# EAGLE board ESP32-P4 Display 9.0 inch V1.0 (EAGLE 9.6.2), part 1 of 3
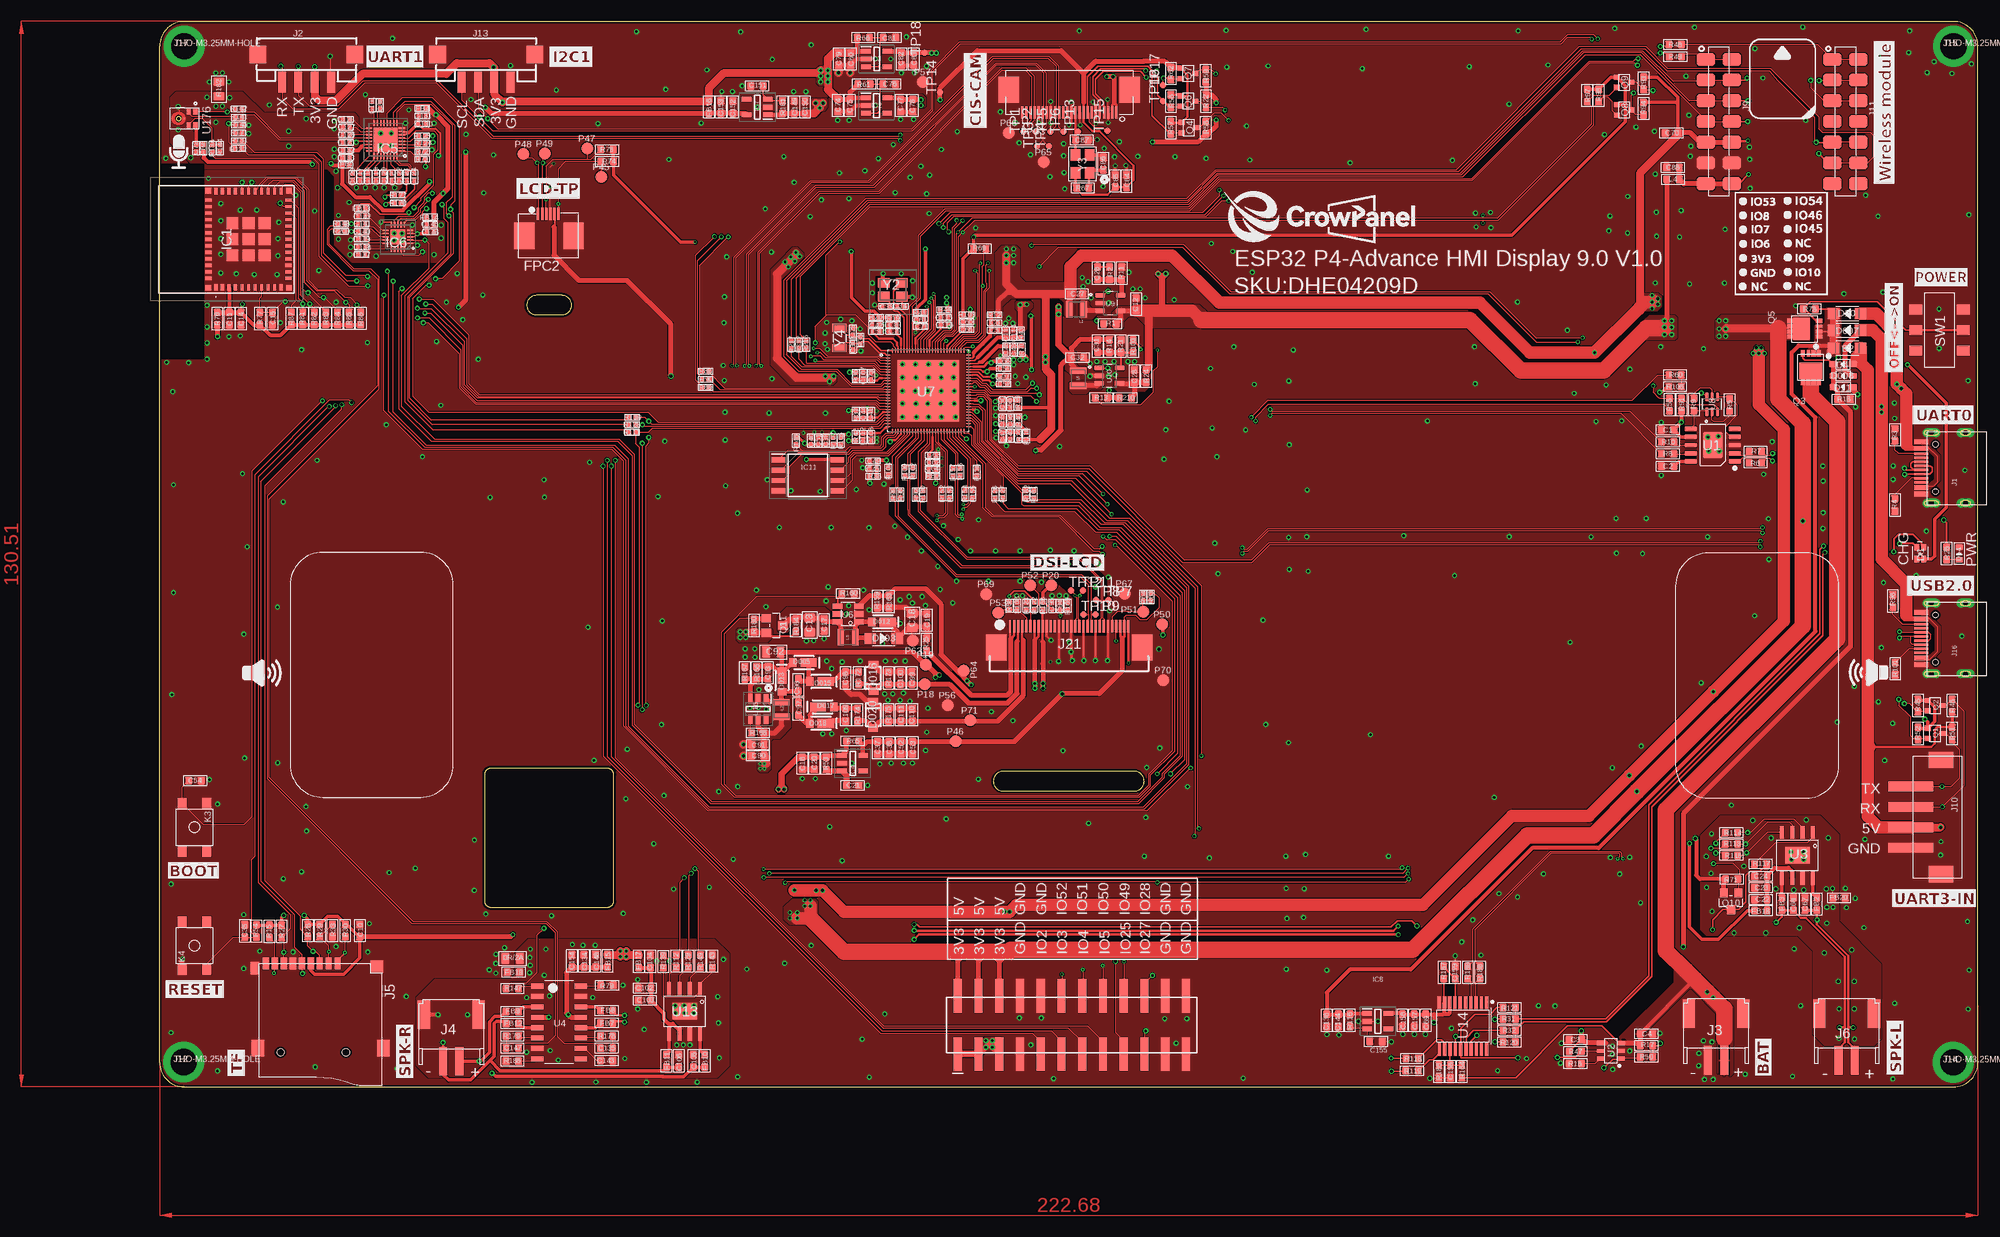
[diagram p9: board, top side]
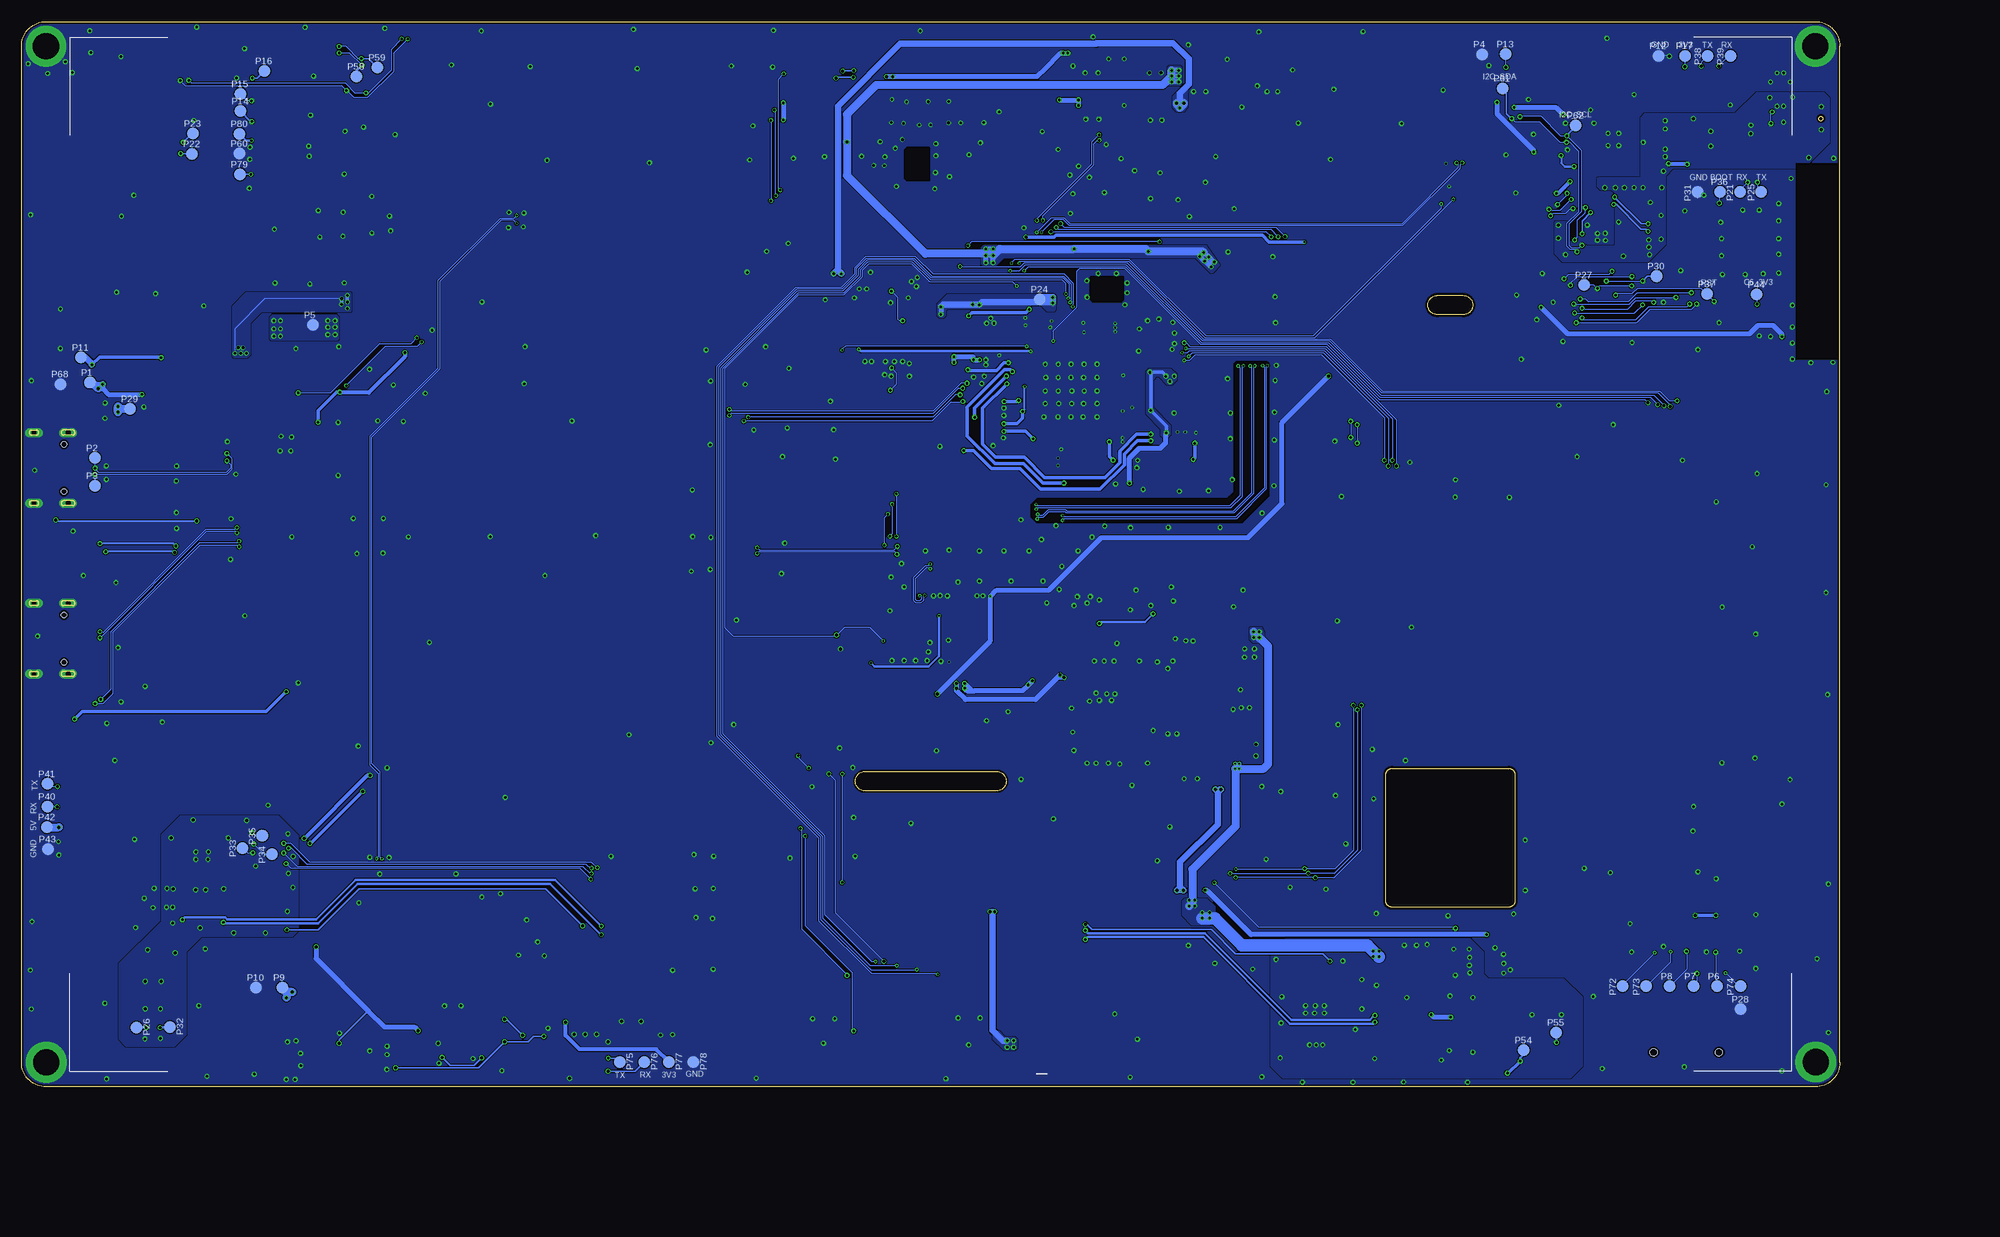
[diagram p10: board, bottom side, seen from below]

Size 222.7 x 130.5 mm. Coordinates in mm from the lower left corner, seen from the top.
Outline: 0,3 0,127.5 arc-90 3,130.5 219.7,130.5 arc-90 222.7,127.5 222.7,3 arc-90 219.7,0 3,0 arc-90 0,3
Outline: 103.28,36.26 119.4,36.26 arc180 119.4,38.64 103.28,38.64 arc180 103.28,36.26
Outline: 39.8,38.27 39.8,22.77 arc90 40.55,22.02 54.85,22.02 arc90 55.6,22.77 55.6,38.27 arc90 54.85,39.02 40.55,39.02 arc90 39.8,38.27
Outline: 46.14,94.58 49.26,94.58 arc180 49.26,96.96 46.14,96.96 arc180 46.14,94.58
Outline: circle at 2.32,118.62 radius 0.25
Copper layers (1*16): Top 0.035mm / dielectric 1.5mm / Bottom 0.035mm
Design rules "default *": minimum track width 4mil, minimum drill 0.2mm, track to track 4mil, track to pad 6mil, pad to pad 6mil, via to via 6mil, smd to smd 6mil, copper to edge 10mil, drill to drill 6mil, minimum pad ring 10mil, minimum via ring 4mil, stop-mask expansion 4mil, vias tented up to drill 100mil, thermal gap 10mil

## Footprints (pad centres in the part's own frame; a part is rotated, then mirrored left to right if it is on the bottom)
L0805 = smd 1.016 x 1.397: 1 -0.889,0; 2 0.889,0
0603 = smd 0.889 x 0.889: 1 -0.762,0; 2 0.762,0
C0402 = smd 0.6 x 0.6: 1 -0.45,0; 2 0.45,0
C0805 = smd 1.016 x 1.397: 1 -0.889,0; 2 0.889,0
LED_KT-0603RYG = smd 0.85 x 0.6: 1 0.725,-0.425; 2 0.725,0.425; 3 -0.725,-0.425; 4 -0.725,0.425
D_SOD123FL = smd 1.397 x 1.397: + -1.651,0; - 1.651,0
D_SOD323 = smd 1 x 0.8: + -1.2,0; - 1.2,0
LMBR140ET1G = smd 2 x 1.1: 1 -0.975,0 | smd 0.9 x 1.1: 2 0.975,0
LED0603 = smd 0.762 x 0.889: + -0.762,0; - 0.762,0
LMSZ5233BT1G = smd 0.91 x 1.22: 1 -1.635,0; 2 1.635,0
L0603 = smd 0.889 x 0.889: 1 -0.762,0; 2 0.762,0
L0402 = smd 0.635 x 0.635: 1 -0.445,0; 2 0.445,0
R0402 = smd 0.635 x 0.635: 1 -0.445,0; 2 0.445,0
FPC-6PIN-0.5MM = smd 0.3 x 1.5: 1 -1.31,2.184; 2 -0.81,2.184; 3 -0.31,2.184; 4 0.19,2.184; 5 0.69,2.184; 6 1.19,2.184 | smd 2.5 x 3.2: 7 -3.01,-0.496; 8 3.036,-0.496
FPC-SMD_P0.50-24P_QCHF-SM-H2.0 = smd 0.3 x 1.5: 1 5.75,-1.574; 2 5.25,-1.574; 3 4.75,-1.574; 4 4.25,-1.574; 5 3.75,-1.574; 6 3.25,-1.574; 7 2.75,-1.574; 8 2.25,-1.574; 9 1.75,-1.574; 10 1.25,-1.574; 11 0.75,-1.574; 12 0.25,-1.574; 13 -0.25,-1.574; 14 -0.75,-1.574; 15 -1.25,-1.574; 16 -1.75,-1.574; 17 -2.25,-1.574; 18 -2.75,-1.574; 19 -3.25,-1.574; 20 -3.75,-1.574; 21 -4.25,-1.574; 22 -4.75,-1.574; 23 -5.25,-1.574; 24 -5.75,-1.574 | smd 2.5 x 3.2: 25 7.4,1.195; 26 -7.4,1.195
ESP32C6MINI1N4 = smd 0.8 x 0.4: 1 -5.9,4; 2 -5.9,3.2; 3 -5.9,2.4; 4 -5.9,1.6; 5 -5.9,0.8; 6 -5.9,0; 7 -5.9,-0.8; 8 -5.9,-1.6; 9 -5.9,-2.4; 10 -5.9,-3.2; 11 -5.9,-4; 25 5.9,-4; 26 5.9,-3.2; 27 5.9,-2.4; 28 5.9,-1.6; 29 5.9,-0.8; 30 5.9,0; 31 5.9,0.8; 32 5.9,1.6; 33 5.9,2.4; 34 5.9,3.2; 35 5.9,4 | smd 0.4 x 0.8: 12 -4.8,-4.9; 13 -4,-4.9; 14 -3.2,-4.9; 15 -2.4,-4.9; 16 -1.6,-4.9; 17 -0.8,-4.9; 18 0,-4.9; 19 0.8,-4.9; 20 1.6,-4.9; 21 2.4,-4.9; 22 3.2,-4.9; 23 4,-4.9; 24 4.8,-4.9; 36 4.8,4.9; 37 4,4.9; 38 3.2,4.9; 39 2.4,4.9; 40 1.6,4.9; 41 0.8,4.9; 42 0,4.9; 43 -0.8,4.9; 44 -1.6,4.9; 45 -2.4,4.9; 46 -3.2,4.9; 47 -4,4.9; 48 -4.8,4.9 | smd 1.45 x 1.45: 49 0,0; 54 -1.975,1.975; 55 -1.975,0; 56 -1.975,-1.975; 57 0,-1.975; 58 1.975,-1.975; 59 1.975,0; 60 1.975,1.975; 61 0,1.975 | smd 0.7 x 0.7: 50 5.95,4.95; 51 5.95,-4.95; 52 -5.95,-4.95; 53 -5.95,4.95
SOT95P282X145-5N = smd 1.2 x 0.6: 1 -1.3,0.95; 2 -1.3,0; 3 -1.3,-0.95; 4 1.3,-0.95; 5 1.3,0.95
QFN40P400X400X80-33N = smd 0.75 x 0.2: 1 -2,1.4; 2 -2,1; 3 -2,0.6; 4 -2,0.2; 5 -2,-0.2; 6 -2,-0.6; 7 -2,-1; 8 -2,-1.4; 17 2,-1.4; 18 2,-1; 19 2,-0.6; 20 2,-0.2; 21 2,0.2; 22 2,0.6; 23 2,1; 24 2,1.4 | smd 0.2 x 0.75: 9 -1.4,-2; 10 -1,-2; 11 -0.6,-2; 12 -0.2,-2; 13 0.2,-2; 14 0.6,-2; 15 1,-2; 16 1.4,-2; 25 1.4,2; 26 1,2; 27 0.6,2; 28 0.2,2; 29 -0.2,2; 30 -0.6,2; 31 -1,2; 32 -1.4,2 | smd 2.9 x 2.9: 33 0,0
QFN40P300X300X60-21N = smd 0.75 x 0.2: 1 -1.5,0.8; 2 -1.5,0.4; 3 -1.5,0; 4 -1.5,-0.4; 5 -1.5,-0.8; 11 1.5,-0.8; 12 1.5,-0.4; 13 1.5,0; 14 1.5,0.4; 15 1.5,0.8 | smd 0.2 x 0.75: 6 -0.8,-1.5; 7 -0.4,-1.5; 8 0,-1.5; 9 0.4,-1.5; 10 0.8,-1.5; 16 0.8,1.5; 17 0.4,1.5; 18 0,1.5; 19 -0.4,1.5; 20 -0.8,1.5 | smd 1.8 x 1.8: 21 0,0
SOIC127P790X216-8N = smd 1.65 x 0.65: 1 -3.6,1.905; 2 -3.6,0.635; 3 -3.6,-0.635; 4 -3.6,-1.905; 5 3.6,-1.905; 6 3.6,-0.635; 7 3.6,0.635; 8 3.6,1.905
USB-3.0TYPEC-SMD = smd 0.3 x 1.7: A1 -3.35,0.5; A4 -2.55,0.5; A5 -1.25,0.5; A6 -0.25,0.5; A7 0.25,0.5; A8 1.25,0.5; A9 2.55,0.5; A12 3.35,0.5; B1 3.05,0.5; B4 2.25,0.5; B5 1.75,0.5; B6 0.75,0.5; B7 -0.75,0.5; B8 -1.75,0.5; B9 -2.25,0.5; B12 -3.05,0.5 | drill 0.6 pad 1.016 long: P$1 -4.325,-0.72; P$2 4.325,-0.72; P$3 -4.325,-4.9; P$4 4.325,-4.9 | hole 0.68: -2.89,-1.22; 2.89,-1.22
CONNECTOR_4P-SMD-2.0 = smd 0.965 x 2.54: 1 -3,0; 2 -1,0; 3 1,0; 4 3,0 | smd 2.032 x 2.184: SS1 -5.946,3.4; SS2 5.946,3.4
PH2.0WT-2PIN = smd 1 x 3.5: P$1 -1,0; P$2 1,0 | smd 1.5 x 3.5: P$3 -3.35,-5.7; P$4 3.35,-5.7
9P-SMD-W/-RING = smd 1.524 x 0.762: 1 0,4.4; 2 0,3.3; 3 0,2.2; 4 0,1.1; 5 0,0; 6 0,-1.1; 7 0,-2.2; 8 0,-3.3; 9 0,-4.4 | smd 1.524 x 1.016: G1 0.6,-5.746 | smd 2.032 x 1.524: G2 10.373,-5.4; G3 10.373,10 | smd 1.524 x 1.524: G4 0.392,9.181 | hole 0.889: 10.9,-2.6; 10.9,5.4
2X12_SMD = smd 4.14 x 0.991: 1 -3.569,13.97; 2 3.569,13.97; 3 -3.569,11.43; 4 3.569,11.43; 5 -3.569,8.89; 6 3.569,8.89; 7 -3.569,6.35; 8 3.569,6.35; 9 -3.569,3.81; 10 3.569,3.81; 11 -3.569,1.27; 12 3.569,1.27; 13 -3.569,-1.27; 14 3.569,-1.27; 15 -3.569,-3.81; 16 3.569,-3.81; 17 -3.569,-6.35; 18 3.569,-6.35; 19 -3.569,-8.89; 20 3.569,-8.89; 21 -3.569,-11.43; 22 3.569,-11.43; 23 -3.569,-13.97; 24 3.569,-13.97
H7-2.54-18.28X2.5X5MM = smd 1.65 x 2.3: 1 -7.62,-1.58; 1-1 -7.62,1.58; 2 -5.08,-1.58; 2-2 -5.08,1.58; 3 -2.54,-1.58; 3-3 -2.54,1.58; 4 0,-1.58; 4-4 0,1.58; 5 2.54,-1.58; 5-5 2.54,1.58; 6 5.08,-1.58; 6-6 5.08,1.58; 7 7.62,-1.58; 7-7 7.62,1.58
XH2.54-4P-SMD = smd 1.2 x 5.5: 1 -3.75,-1.875; 2 -1.25,-1.875; 3 1.25,-1.875; 4 3.75,-1.875 | smd 2 x 3: 5 -7,1.875; 6 7,1.875
THO-M3.2*5MM-HOLE = drill 3.2 pad 5: P$1 0,0
C23398852_30P_0.5MM_下接_FC-05A30P11H20 = smd 0.3 x 1.5: 1 -7.25,1.3; 2 -6.75,1.3; 3 -6.25,1.3; 4 -5.75,1.3; 5 -5.25,1.3; 6 -4.75,1.3; 7 -4.25,1.3; 8 -3.75,1.3; 9 -3.25,1.3; 10 -2.75,1.3; 11 -2.25,1.3; 12 -1.75,1.3; 13 -1.25,1.3; 14 -0.75,1.3; 15 -0.25,1.3; 16 0.25,1.3; 17 0.75,1.3; 18 1.25,1.3; 19 1.75,1.3; 20 2.25,1.3; 21 2.75,1.3; 22 3.25,1.3; 23 3.75,1.3; 24 4.25,1.3; 25 4.75,1.3; 26 5.25,1.3; 27 5.75,1.3; 28 6.25,1.3; 29 6.75,1.3; 30 7.25,1.3 | smd 2.5 x 3.2: 31 8.95,-1.3; 32 -8.95,-1.3
KEY-4.5X4.5-SMD = smd 1.35 x 1.1: 1 -2.925,1.5; 2 -2.925,-1.5; 3 2.925,-1.5; 4 2.925,1.5
1008(2520) = smd 0.8 x 2: 1 -0.9,0; 2 0.9,0
TEST_PAD-1.5MM = smd 1.5 x 1.5: P$1 0,0
MOS_SOT323 = smd 0.635 x 0.762: 1 -0.635,-0.889; 2 0.635,-0.889; 3 0,0.889
PDFN3333 = smd 0.5 x 0.8: 1 -0.975,-1.725; 2 -0.325,-1.725; 4 0.975,-1.725; 5 0.975,1.725; 6 0.325,1.725; 7 -0.325,1.725; 8 -0.975,1.725 | smd 0.4 x 0.8: 3 0.325,-1.725 | smd 2.8 x 2: 9 0,0.4
PMOS_SOT23 = smd 1.016 x 1.143: 1 -0.889,-1.016; 2 0.889,-1.016; 3 0,1.016
R0603 = smd 0.889 x 0.889: 1 -0.762,0; 2 0.762,0
R0603-SP = smd 0.889 x 0.889: 1 -0.762,0; 2 0.762,0
R0805 = smd 1.016 x 1.397: 1 -0.889,0; 2 0.889,0
SWITCH_6PIN_2P = smd 1.2 x 1.6: 1 2.5,-2.9; 2 0,-2.9; 3 -2.5,-2.9; 4 -2.5,2.9; 5 0,2.9; 6 2.5,2.9
TP08R = smd 0.8 x 0.8: TP 0,0
ESOP-10-EP-150MIL = smd 1.5 x 0.6: 1 -2.7,2; 2 -2.7,1; 3 -2.7,0; 4 -2.7,-1; 5 -2.7,-2; 6 2.7,-2; 7 2.7,-1; 8 2.7,0; 9 2.7,1; 10 2.7,2 | smd 2.4 x 3.2: EP 0,0
SOT23-6L = smd 0.5 x 0.9: 1 -0.961,-1.212; 2 -0.011,-1.212; 3 0.94,-1.212; 4 0.94,1.288; 5 -0.011,1.288; 6 -0.961,1.288
NS4168-ESOP-8 = smd 1.6 x 0.5: 1 -2.8,1.905; 2 -2.8,0.635; 3 -2.8,-0.635; 4 -2.8,-1.905; 5 2.8,-1.905; 6 2.8,-0.635; 7 2.8,0.635; 8 2.8,1.905 | smd 2 x 3: 9 0,0
SOP16 = smd 0.635 x 1.524: 1 0,0; 2 1.27,0; 3 2.54,0; 4 3.81,0; 5 5.08,0; 6 6.35,0; 7 7.62,0; 8 8.89,0; 9 8.89,5.334; 10 7.62,5.334; 11 6.35,5.334; 12 5.08,5.334; 13 3.81,5.334; 14 2.54,5.334; 15 1.27,5.334; 16 0,5.334
COOPER_SOT23-6 = smd 0.69 x 1.2: 1 -0.95,-1.3; 2 0,-1.3; 3 0.95,-1.3; 4 0.95,1.3; 5 0,1.3; 6 -0.95,1.3
IC_ESP32-P4NRW32 = smd 0.65 x 0.18: 1 -4.925,4.375; 2 -4.925,4.025; 3 -4.925,3.675; 4 -4.925,3.325; 5 -4.925,2.975; 6 -4.925,2.625; 7 -4.925,2.275; 8 -4.925,1.925; 9 -4.925,1.575; 10 -4.925,1.225; 11 -4.925,0.875; 12 -4.925,0.525; 13 -4.925,0.175; 14 -4.925,-0.175; 15 -4.925,-0.525; 16 -4.925,-0.875; 17 -4.925,-1.225; 18 -4.925,-1.575; 19 -4.925,-1.925; 20 -4.925,-2.275; 21 -4.925,-2.625; 22 -4.925,-2.975; 23 -4.925,-3.325; 24 -4.925,-3.675; 25 -4.925,-4.025; 26 -4.925,-4.375; 53 4.925,-4.375; 54 4.925,-4.025; 55 4.925,-3.675; 56 4.925,-3.325; 57 4.925,-2.975; 58 4.925,-2.625; 59 4.925,-2.275; 60 4.925,-1.925; 61 4.925,-1.575; 62 4.925,-1.225; 63 4.925,-0.875; 64 4.925,-0.525; 65 4.925,-0.175; 66 4.925,0.175; 67 4.925,0.525; 68 4.925,0.875; 69 4.925,1.225; 70 4.925,1.575; 71 4.925,1.925; 72 4.925,2.275; 73 4.925,2.625; 74 4.925,2.975; 75 4.925,3.325; 76 4.925,3.675; 77 4.925,4.025; 78 4.925,4.375 | smd 0.18 x 0.65: 27 -4.375,-4.925; 28 -4.025,-4.925; 29 -3.675,-4.925; 30 -3.325,-4.925; 31 -2.975,-4.925; 32 -2.625,-4.925; 33 -2.275,-4.925; 34 -1.925,-4.925; 35 -1.575,-4.925; 36 -1.225,-4.925; 37 -0.875,-4.925; 38 -0.525,-4.925; 39 -0.175,-4.925; 40 0.175,-4.925; 41 0.525,-4.925; 42 0.875,-4.925; 43 1.225,-4.925; 44 1.575,-4.925; 45 1.925,-4.925; 46 2.275,-4.925; 47 2.625,-4.925; 48 2.975,-4.925; 49 3.325,-4.925; 50 3.675,-4.925; 51 4.025,-4.925; 52 4.375,-4.925; 79 4.375,4.925; 80 4.025,4.925; 81 3.675,4.925; 82 3.325,4.925; 83 2.975,4.925; 84 2.625,4.925; 85 2.275,4.925; 86 1.925,4.925; 87 1.575,4.925; 88 1.225,4.925; 89 0.875,4.925; 90 0.525,4.925; 91 0.175,4.925; 92 -0.175,4.925; 93 -0.525,4.925; 94 -0.875,4.925; 95 -1.225,4.925; 96 -1.575,4.925; 97 -1.925,4.925; 98 -2.275,4.925; 99 -2.625,4.925; 100 -2.975,4.925; 101 -3.325,4.925; 102 -3.675,4.925; 103 -4.025,4.925; 104 -4.375,4.925 | smd 7.5 x 7.5: 105 0,0
SOP65P210X100-6N = smd 1.09 x 0.4: 1 -0.92,0.65; 2 -0.92,0; 3 -0.92,-0.65; 4 0.92,-0.65; 5 0.92,0; 6 0.92,0.65
SOT95P280X145-5N = smd 1.21 x 0.59: 1 -1.255,0.95; 2 -1.255,0; 3 -1.255,-0.95; 4 1.255,-0.95; 5 1.255,0.95
TSSOP20 = smd 1.572 x 0.41: 1 -2.872,2.275; 2 -2.872,1.625; 3 -2.872,0.975; 4 -2.872,0.325; 5 -2.872,-0.325; 6 -2.872,-0.975; 7 -2.872,-1.625; 8 -2.872,-2.275; 9 -2.872,-2.895; 10 -2.872,-3.545; 11 2.872,-3.515; 12 2.872,-2.865; 13 2.872,-2.215; 14 2.872,-1.565; 15 2.872,-0.915; 16 2.872,-0.265; 17 2.872,0.355; 18 2.872,1.005; 19 2.872,1.625; 20 2.872,2.275
SOT95P280X145-6N = smd 1.2 x 0.6: 1 -1.25,0.95; 2 -1.25,0; 3 -1.25,-0.95; 4 1.25,-0.95; 5 1.25,0; 6 1.25,0.95
MIC-SMD_5P-L3.5-W2.7 = smd 0.725 x 0.522: 1 -0.838,1.362; 2 -0.838,0.542; 3 0.838,0.542; 4 0.838,1.362 | smd 0.25 x 0.25: 5_1 0,-0.048
X322540MPB4SI = smd 1.4 x 1.2: 1 -1.1,-0.85; 2 1.1,-0.85; 3 1.1,0.85; 4 -1.1,0.85
24MHZ_1631-24003-BTKEYA = smd 1.4 x 1.2: 1 -1.1,-0.875; 2 1.1,-0.875; 3 1.1,0.875; 4 -1.1,0.875
NORDIC_NRF_XTAL_3215_N = smd 1 x 1.8: 1 -1.25,0; 2 1.25,0

## Placement (x,y rotation side)
0R/2A  0R/800mA  [L0805]  43.24,15.74 0 top
C1  1uF  [0603]  184.7,80.49 0 top
C2  1uF  [0603]  184.7,76.04 0 top
C3  1uF  [0603]  173.4,5.79 0 top
C4  10uF/NC  [0603]  182.1,6.5 180 top
C5  100nF  [C0402]  102.24,92.7 0 top
C6  10uF  [C0402]  102.26,93.6 180 top
C7  100nF  [C0402]  89.84,92.53 180 top
C8  10uF  [C0402]  89.84,93.37 0 top
C9  100nF  [C0402]  87.73,92.54 0 top
C10  1uF  [0603]  24.51,19.15 270 top
C11  100nF  [0603]  8.54,94.1 270 top
C12  10uF/10V+  [0603]  119.58,95.88 90 top
C13  22uF  [C0805]  79.62,56.59 270 top
C14  10uF  [0603]  9.97,94.1 90 top
C15  100nF  [0603]  13.81,94.1 270 top
C16  10uF  [0603]  78.7,39.65 90 top
C17  1uF  [0603]  81.37,56.59 90 top
C18  22uF  [C0805]  92.16,57.13 90 top
C19  100nF  [0603]  93.95,57.16 90 top
C20  100nF  [0603]  80.17,39.65 90 top
C21  100nF  [0603]  84.87,36.92 180 top
C22  1uF  [0603]  196.11,22.96 180 top
C23  47uF  [0603]  196.11,24.39 180 top
C24  47uF  [0603]  196.11,25.79 180 top
C26  22pF  [0603]  114.87,99.68 90 top
C27  10uF/10V+  [0603]  112.31,97.14 180 top
C28  10uF/10V+  [0603]  119.38,87.08 90 top
C29  12pF  [C0402]  84.91,92.53 90 top
C30  12pF  [C0402]  84.92,90.7 270 top
C31  22pF  [0603]  114.89,90.75 90 top
C32  10uF/10V+  [0603]  112.41,89.34 180 top
C33  15pF  [C0402]  88.94,95.64 180 top
C34  15pF  [C0402]  90.78,95.64 180 top
C35  100nF  [0603]  10.42,19.09 270 top
C36  100nF  [C0402]  104.17,81.63 90 top
C37  100nF  [0603]  87.91,41.55 90 top
C38  10uF  [0603]  89.35,41.55 90 top
C39  100nF  [C0402]  81.56,79.16 90 top
C40  100nF  [C0402]  79.76,79.16 90 top
C41  100nF  [C0402]  87.14,82.41 90 top
C42  10uF  [C0402]  87.74,93.38 180 top
C43  100nF  [C0402]  104.17,79.76 270 top
C44  10uF  [C0402]  86.19,82.41 270 top
C45  100nF  [C0402]  87.38,75.76 180 top
C46  100nF  [C0402]  103.66,90.32 270 top
C47  10uF  [C0402]  103.22,79.75 90 top
C48  10uF  [C0402]  104.6,90.32 90 top
C49  10uF  [C0402]  87.38,76.68 0 top
C50  100nF  [C0402]  103.22,83.67 270 top
C51  1uF  [C0402]  80.66,79.16 90 top
C52  100nF  [0603]  90.8,41.55 90 top
C53  100nF  [0603]  92.23,41.55 90 top
C54  100nF  [0603]  4.33,37.52 180 top
C55  1uF  [C0402]  103.23,81.65 90 top
C56  10uF  [C0402]  104.16,83.67 90 top
C57  1uF  [C0402]  103.37,87.06 0 top
C58  1uF  [C0402]  103.37,86.1 0 top
C59  1uF  [C0402]  103.37,88 0 top
C60  100nF  [C0402]  98.83,93.71 0 top
C61  100nF  [C0402]  93.15,94.05 180 top
C62  10nF  [C0402]  94.68,76.51 0 top
C63  100nF  [C0402]  94.67,77.38 0 top
C64  1uF  [C0402]  94.66,75.68 0 top
C65  1uF  [C0402]  98.83,92.79 0 top
C66  1uF  [C0402]  103.37,88.92 0 top
C67  1nF  [0603]  201.52,22.4 270 top
C68  1nF  [0603]  200.09,22.4 270 top
C69  1uF  [0603]  155.05,8.15 90 top
C70  10UF  [0603]  185.15,116.85 180 top
C71  10uF  [C0402]  93.17,93.17 0 top
C72  100nF  [C0402]  4.46,114.97 90 top
C73  100nF  [C0402]  87.14,87.09 90 top
C74  10uF  [0603]  83.06,120.22 90 top
C75  100nF  [0603]  84.53,120.22 90 top
C76  100nF  [0603]  89.35,122.84 180 top
C77  100nF  [0603]  90.77,120.22 90 top
C78  10uF  [0603]  92.26,120.22 90 top
C79  10uF  [0603]  83.16,125.92 90 top
C80  100nF  [0603]  84.67,125.92 90 top
C81  100nF  [0603]  89.38,128.54 180 top
C82  100nF  [0603]  90.86,125.92 90 top
C83  10uF  [0603]  92.36,125.92 90 top
C84  100nF  [0603]  118.41,110.96 270 top
C85  1nF  [0603]  117.02,110.98 270 top
C86  1uF  [0603]  115.57,113.08 270 top
C87  15pF  [0603]  112.94,116.02 180 top
C88  10UF_NC  [0603]  185.35,112.62 180 top
C89  22pF  [C0402]  27,120.27 90 top
C90  10uF/25V  [0603]  73.27,40.56 180 top
C91  100nF/50V  [0603]  73.26,41.94 180 top
C92  22uF/16V  [C0805]  75.15,53.27 180 top
C93  10nF/25V  [0603]  74.5,50.73 270 top
C94  10uF/25V  [C0402]  110.24,58.93 90 top
C95  100nF/50V  [C0402]  109.31,58.93 90 top
C96  1uF/25V  [0603]  78.22,49.25 90 top
C97  1uF/25V  [0603]  78.23,46.29 270 top
C98  1uF/50V  [0603]  84,50.09 270 top
C99  10uF/25V  [0603]  92.15,50.09 90 top
C100  100nF/50V  [0603]  90.73,50.09 90 top
C101  22pF  [C0402]  26.05,120.27 90 top
C102  1uF  [0603]  59.41,12.1 180 top
C103  47uF  [0603]  59.41,10.6 180 top
C104  47uF  [0603]  60.1,15.37 90 top
C105  1nF  [0603]  65.36,3.19 270 top
C106  1nF  [0603]  63.57,3.19 270 top
C107  10uF  [C0402]  86.19,87.09 270 top
C108  100nF  [C0402]  87.14,79.63 270 top
C109  1uF/50V  [0603]  84.01,45.58 270 top
C110  10uF/25V  [0603]  92.18,45.58 90 top
C111  100nF/50V  [0603]  90.78,45.58 90 top
C112  10uF  [C0402]  86.19,79.63 90 top
C113  100nF  [C0402]  103.6,92.27 90 top
C114  10uF  [C0402]  104.53,92.27 270 top
C115  100nF  [C0402]  96.07,94.26 0 top
C116  10uF  [C0402]  96.08,93.33 180 top
C117  1uF  [C0402]  24.59,111.47 90 top
C118  1uF  [C0402]  25.54,111.47 90 top
C119  1uF  [C0402]  26.48,111.47 90 top
C120  1uF  [C0402]  27.43,111.47 90 top
C121  1uF  [C0402]  28.37,111.47 90 top
C122  1uF  [C0402]  29.32,111.47 90 top
C123  1uF  [C0402]  30.26,111.47 90 top
C124  1uF  [C0402]  31.21,111.47 90 top
C125  1uF  [C0402]  22.82,115.67 180 top
C126  1uF  [C0402]  22.82,116.61 180 top
C127  1uF  [C0402]  22.82,117.56 180 top
C128  1uF  [C0402]  22.82,118.5 180 top
C129  1uF  [C0402]  23.64,111.46 270 top
C130  100nF  [C0402]  32.15,117.98 0 top
C131  1uF  [C0402]  32.16,118.93 180 top
C132  100nF  [C0402]  22.82,114.73 180 top
C133  1uF  [C0402]  22.81,113.82 0 top
C134  47uF  [0603]  51.97,15.43 270 top
C135  100nF  [0603]  54.74,4.74 0 top
C136  10uF  [0603]  142.95,8.15 90 top
C137  1uF  [C0402]  24.73,101.95 0 top
C138  1uF  [C0402]  24.74,102.9 180 top
C139  1uF  [C0402]  24.74,103.85 180 top
C140  1uF  [C0402]  24.74,104.79 180 top
C141  1uF  [C0402]  24.74,105.74 180 top
C142  1uF  [C0402]  24.74,106.68 180 top
C143  1uF  [0603]  54.74,3.24 180 top
C144  100nF  [0603]  144.35,8.15 90 top
C145  100nF  [C0402]  33.13,105.63 0 top
C146  1uF  [C0402]  33.14,104.72 180 top
C147  100nF  [0603]  43.2,4.77 180 top
C148  47uF  [0603]  53.39,15.45 270 top
C149  10uF  [0603]  77.71,120.03 270 top
C150  100nF  [0603]  79.05,120.03 270 top
C151  100nF  [0603]  73.16,122.63 0 top
C152  100nF  [0603]  70.2,120.03 270 top
C153  10uF  [0603]  68.73,120.03 270 top
C154  100nF  [0603]  50.49,15.43 90 top
C155  100nF  [0603]  148.97,5.57 180 top
C156  100nF  [0603]  152.21,8.15 90 top
C157  10uF  [0603]  153.64,8.15 90 top
C158  1nF  [0603]  158.08,1.89 90 top
C159  100nF  [0603]  158.67,14.01 270 top
D1  KT-0603RYG  [LED_KT-0603RYG]  215.63,65.38 270 top
D2  DSS34  [D_SOD123FL]  206.68,90.5 180 top
D003  NC/DSS34  [D_SOD123FL]  88.68,54.93 0 top
D4  1N5817WS  [D_SOD323]  206.17,88.52 180 top
D005  LMBR140ET1G  [LMBR140ET1G]  78.5,51.96 180 top
D007  DSS34  [D_SOD123FL]  206.68,92.67 180 top
D008  1N5817WS  [D_SOD323]  206.21,87.1 180 top
D10  DSS34  [D_SOD123FL]  206.68,94.72 180 top
D11  1N5817WS  [D_SOD323]  206.22,85.71 180 top
D012  LMBR140ET1G  [LMBR140ET1G]  88.18,56.96 180 top
D013  LMBR140ET1G  [LMBR140ET1G]  76.2,49.4 270 top
D14  Red  [LED0603]  220.42,65.35 90 top
D015  LMBR140ET1G  [LMBR140ET1G]  80.6,49.64 180 top
D016  MM1W18_18V  [LMSZ5233BT1G]  87.4,50.09 90 top
D017  LMBR140ET1G  [LMBR140ET1G]  81.61,46.56 0 top
D018  LMBR140ET1G  [LMBR140ET1G]  80.6,44.54 180 top
D020  LMSZ5233BT1G_-6V  [LMSZ5233BT1G]  87.38,45.58 270 top
FB2  1K/磁珠  [L0603]  202.96,22.4 270 top
FB3  1K/磁珠  [L0603]  198.68,22.4 270 top
FB4  0R/800mA  [L0402]  32.17,119.86 180 top
FB5  0R/800mA  [L0402]  22.79,112.92 0 top
FB6  0R/800mA  [L0402]  5.39,114.97 90 top
FB7  1K/磁珠  [L0603]  54.74,7.84 0 top
FB8  1K/磁珠  [L0603]  54.74,9.34 0 top
FB9  1K/磁珠  [L0603]  43.19,9.24 180 top
FB10  1K/磁珠  [L0603]  66.76,3.19 270 top
FB11  1K/磁珠  [L0603]  62.07,3.19 270 top
FB12  1K/磁珠  [L0603]  43.19,7.74 180 top
FB13  0R/800mA  [L0402]  24.75,107.64 180 top
FB14  0R/800mA  [R0402]  33.12,106.54 180 top
FB15  0R/2A  [L0603]  54.86,15.43 270 top
FB16  0R/800mA_NC  [L0603]  67.26,120.03 270 top
FB17  0R/2A  [L0603]  58.68,15.37 90 top
FB18  0R/2A  [L0603]  196.11,21.58 180 top
FB19  0R/2A  [L0603]  43.34,14.04 0 top
FB20  0R/2A  [L0603]  205.68,23.15 180 top
FPC2  FPC-6PIN-0.5MM  [FPC-6PIN-0.5MM]  47.66,104.74 0 top
FPC3  AFC24-S24FIA-00  [FPC-SMD_P0.50-24P_QCHF-SM-H2.0]  111.41,120.95 0 top
IC1  ESP32-C6-MINI-1-N4  [ESP32C6MINI1N4]  10.89,103.82 90 top
IC2  ME6211C18M5G-N  [SOT95P282X145-5N]  87.81,120.22 0 top
IC3  ME6211C28M5G-N  [SOT95P282X145-5N]  87.82,125.92 0 top
IC4  ME6211C18M5G-N_NC  [SOT95P282X145-5N]  84.87,39.65 0 top
IC5  ES7210  [QFN40P400X400X80-33N]  27.67,116.03 180 top
IC6  ES8311  [QFN40P300X300X60-21N]  29.17,104.13 180 top
IC7  ME6211C33M5G-N  [SOT95P282X145-5N]  73.19,120.03 180 top
IC8  ME6211C33M5G-N  [SOT95P282X145-5N]  149.2,8.05 0 top
IC11  W25Q128JVSIQ  [SOIC127P790X216-8N]  79.38,74.91 0 top
J1  TYPEC-3.0-16P-SMD  [USB-3.0TYPEC-SMD]  216.27,75.82 90 top
J2  HY2.0-4P-SMT  [CONNECTOR_4P-SMD-2.0]  17.99,123.07 0 top
J3  PH2.0WT-2PIN  [PH2.0WT-2PIN]  190.62,3.26 180 top
J4  PH2.0WT-2PIN  [PH2.0WT-2PIN]  35.71,3.16 180 top
J5  [9P-SMD-W/-RING]  17.41,15.13 270 top
J6  PH2.0WT-2PIN  [PH2.0WT-2PIN]  206.62,3.26 180 top
J7  CONN_12X22X12_SMD  [2X12_SMD]  111.72,7.59 90 top
J9  [H7-2.54-18.28X2.5X5MM]  190.96,118.25 270 top
J10  XH2.54-4P-SMT  [XH2.54-4P-SMD]  216.32,33.05 270 top
J11  [H7-2.54-18.28X2.5X5MM]  206.46,118.25 270 top
J12  THO-M3.25MM-HOLE  [THO-M3.2*5MM-HOLE]  2.94,3.04 0 top
J13  HY2.0-4P-SMT  [CONNECTOR_4P-SMD-2.0]  39.99,123.07 0 top
J14  THO-M3.25MM-HOLE  [THO-M3.2*5MM-HOLE]  219.68,3.01 0 top
J15  THO-M3.25MM-HOLE  [THO-M3.2*5MM-HOLE]  219.7,127.5 0 top
J16  TYPEC-3.0-16P-SMD  [USB-3.0TYPEC-SMD]  216.27,54.92 90 top
J17  THO-M3.25MM-HOLE  [THO-M3.2*5MM-HOLE]  3,127.49 0 top
J21  C23398852_30P_0.5MM_下接_FC-05A30P11H20  [C23398852_30P_0.5MM_下接_FC-05A30P11H20]  111.39,55.13 0 top
K3  KEY-4.5X4.5  [KEY-4.5X4.5-SMD]  4.27,31.79 270 top
K4  KEY-4.5X4.5  [KEY-4.5X4.5-SMD]  4.27,17.3 90 top
L1  2.2μH_C5179446  [1008(2520)]  112.3,95.24 180 top
L2  4.7uH_C45385206_2.4A  [1008(2520)]  76.18,46.25 90 top
L4  NC  [L0603]  185.35,111.17 180 top
L5  4.7uH_C45385206_2.4A  [1008(2520)]  84.31,55.08 0 top
L6  2.2μH_C5179446  [1008(2520)]  112.51,86.79 90 top
P1  TEST_PADPAD-1.5MM  [TEST_PAD-1.5MM]  214.31,86.28 0 bottom
P2  TEST_PADPAD-1.5MM  [TEST_PAD-1.5MM]  213.67,77.04 0 bottom
P3  TEST_PADPAD-1.5MM  [TEST_PAD-1.5MM]  213.68,73.64 0 bottom
P4  TEST_PADPAD-1.5MM  [TEST_PAD-1.5MM]  43.79,126.49 0 bottom
P5  TEST_PADPAD-1.5MM  [TEST_PAD-1.5MM]  187,93.34 0 bottom
P6  TEST_PADPAD-1.5MM  [TEST_PAD-1.5MM]  15.06,12.33 0 bottom
P7  TEST_PADPAD-1.5MM  [TEST_PAD-1.5MM]  17.94,12.33 0 bottom
P8  TEST_PADPAD-1.5MM  [TEST_PAD-1.5MM]  20.83,12.33 0 bottom
P9  TEST_PADPAD-1.5MM  [TEST_PAD-1.5MM]  190.77,12.17 0 bottom
P10  TEST_PADPAD-1.5MM  [TEST_PAD-1.5MM]  193.99,12.17 0 bottom
P11  TEST_PADPAD-1.5MM  [TEST_PAD-1.5MM]  215.42,89.35 0 bottom
P12  TEST_PADPAD-1.5MM  [TEST_PAD-1.5MM]  22.23,126.3 0 bottom
P13  TEST_PADPAD-1.5MM  [TEST_PAD-1.5MM]  40.94,126.5 0 bottom
P14  TEST_PADPAD-1.5MM  [TEST_PAD-1.5MM]  195.88,119.52 0 bottom
P15  TEST_PADPAD-1.5MM  [TEST_PAD-1.5MM]  195.91,121.63 0 bottom
P16  TEST_PADPAD-1.5MM  [TEST_PAD-1.5MM]  192.97,124.45 0 bottom
P17  TEST_PADPAD-1.5MM  [TEST_PAD-1.5MM]  18.98,126.3 0 bottom
P18  TEST_PADPAD-1.5MM  [TEST_PAD-1.5MM]  93.72,49.3 180 top
P19  TEST_PADPAD-1.5MM  [TEST_PAD-1.5MM]  93.83,51.74 0 top
P20  TEST_PADPAD-1.5MM  [TEST_PAD-1.5MM]  109.18,61.42 0 top
P21  TEST_PADPAD-1.5MM  [TEST_PAD-1.5MM]  12.25,109.64 90 bottom
P22  TEST_PADPAD-1.5MM  [TEST_PAD-1.5MM]  201.82,114.3 0 bottom
P23  TEST_PADPAD-1.5MM  [TEST_PAD-1.5MM]  201.71,116.79 0 bottom
P24  TEST_PADPAD-1.5MM  [TEST_PAD-1.5MM]  97.99,96.48 0 bottom
P25  TEST_PADPAD-1.5MM  [TEST_PAD-1.5MM]  9.65,109.64 90 bottom
P26  TEST_PADPAD-1.5MM  [TEST_PAD-1.5MM]  208.61,7.27 270 bottom
P27  TEST_PADPAD-1.5MM  [TEST_PAD-1.5MM]  31.34,98.21 0 bottom
P28  TEST_PADPAD-1.5MM  [TEST_PAD-1.5MM]  12.15,9.5 0 bottom
P29  TEST_PADPAD-1.5MM  [TEST_PAD-1.5MM]  209.42,83.05 0 bottom
P30  TEST_PADPAD-1.5MM  [TEST_PAD-1.5MM]  22.47,99.31 0 bottom
P31  TEST_PADPAD-1.5MM  [TEST_PAD-1.5MM]  17.42,109.6 90 bottom
P32  TEST_PADPAD-1.5MM  [TEST_PAD-1.5MM]  204.53,7.32 270 bottom
P33  TEST_PADPAD-1.5MM  [TEST_PAD-1.5MM]  195.61,29.27 90 bottom
P34  TEST_PADPAD-1.5MM  [TEST_PAD-1.5MM]  192.02,28.49 90 bottom
P35  TEST_PADPAD-1.5MM  [TEST_PAD-1.5MM]  193.22,30.78 90 bottom
P36  TEST_PADPAD-1.5MM  [TEST_PAD-1.5MM]  14.69,109.65 0 bottom
P37  TEST_PADPAD-1.5MM  [TEST_PAD-1.5MM]  16.28,97.11 0 bottom
P38  TEST_PADPAD-1.5MM  [TEST_PAD-1.5MM]  16.18,126.3 90 bottom
P39  TEST_PADPAD-1.5MM  [TEST_PAD-1.5MM]  13.41,126.3 90 bottom
P40  TEST_PADPAD-1.5MM  [TEST_PAD-1.5MM]  219.55,34.34 0 bottom
P41  TEST_PADPAD-1.5MM  [TEST_PAD-1.5MM]  219.55,37.12 0 bottom
P42  TEST_PADPAD-1.5MM  [TEST_PAD-1.5MM]  219.58,31.83 0 bottom
P43  TEST_PADPAD-1.5MM  [TEST_PAD-1.5MM]  219.48,29.13 0 bottom
P44  TEST_PADPAD-1.5MM  [TEST_PAD-1.5MM]  10.2,97.06 0 bottom
P45  TEST_PADPAD-1.5MM  [TEST_PAD-1.5MM]  54.11,111.47 0 top
P46  TEST_PADPAD-1.5MM  [TEST_PAD-1.5MM]  97.5,42.34 0 top
P47  TEST_PADPAD-1.5MM  [TEST_PAD-1.5MM]  52.36,114.95 0 top
P48  TEST_PADPAD-1.5MM  [TEST_PAD-1.5MM]  44.57,114.26 0 top
P49  TEST_PADPAD-1.5MM  [TEST_PAD-1.5MM]  47.18,114.33 0 top
P50  TEST_PADPAD-1.5MM  [TEST_PAD-1.5MM]  122.81,56.66 0 top
P51  TEST_PADPAD-1.5MM  [TEST_PAD-1.5MM]  120.44,58.22 0 top
P52  TEST_PADPAD-1.5MM  [TEST_PAD-1.5MM]  106.64,61.44 0 top
P53  TEST_PADPAD-1.5MM  [TEST_PAD-1.5MM]  102.73,58.08 0 top
P54  TEST_PADPAD-1.5MM  [TEST_PAD-1.5MM]  38.71,4.5 0 bottom
P55  TEST_PADPAD-1.5MM  [TEST_PAD-1.5MM]  34.73,6.67 0 bottom
P56  TEST_PADPAD-1.5MM  [TEST_PAD-1.5MM]  96.5,46.74 0 top
P57  TEST_PADPAD-1.5MM  [TEST_PAD-1.5MM]  93.47,123.1 0 top
P58  TEST_PADPAD-1.5MM  [TEST_PAD-1.5MM]  181.7,123.77 0 bottom
P59  TEST_PADPAD-1.5MM  [TEST_PAD-1.5MM]  179.11,124.87 0 bottom
P60  TEST_PADPAD-1.5MM  [TEST_PAD-1.5MM]  196,114.33 0 bottom
P61  TEST_PADPAD-1.5MM  [TEST_PAD-1.5MM]  41.33,122.32 0 bottom
P62  TEST_PADPAD-1.5MM  [TEST_PAD-1.5MM]  32.35,117.78 0 bottom
P63  TEST_PADPAD-1.5MM  [TEST_PAD-1.5MM]  92.23,54.65 180 top
P64  TEST_PADPAD-1.5MM  [TEST_PAD-1.5MM]  98.48,51 270 top
P65  TEST_PADPAD-1.5MM  [TEST_PAD-1.5MM]  108.28,113.28 0 top
P66  TEST_PADPAD-1.5MM  [TEST_PAD-1.5MM]  104.01,116.86 0 top
P67  TEST_PADPAD-1.5MM  [TEST_PAD-1.5MM]  118.17,60.42 0 top
P68  TEST_PADPAD-1.5MM  [TEST_PAD-1.5MM]  217.95,86.09 0 bottom
P69  TEST_PADPAD-1.5MM  [TEST_PAD-1.5MM]  101.24,60.37 0 top
P70  TEST_PADPAD-1.5MM  [TEST_PAD-1.5MM]  122.92,49.82 0 top
P71  TEST_PADPAD-1.5MM  [TEST_PAD-1.5MM]  99.26,44.89 0 top
P72  TEST_PADPAD-1.5MM  [TEST_PAD-1.5MM]  26.59,12.33 90 bottom
P73  TEST_PADPAD-1.5MM  [TEST_PAD-1.5MM]  23.71,12.33 90 bottom
P74  TEST_PADPAD-1.5MM  [TEST_PAD-1.5MM]  12.18,12.33 90 bottom
P75  TEST_PADPAD-1.5MM  [TEST_PAD-1.5MM]  149.43,3.04 270 bottom
P76  TEST_PADPAD-1.5MM  [TEST_PAD-1.5MM]  146.42,3.04 270 bottom
P77  TEST_PADPAD-1.5MM  [TEST_PAD-1.5MM]  143.41,3.04 270 bottom
P78  TEST_PADPAD-1.5MM  [TEST_PAD-1.5MM]  140.4,3.04 270 bottom
P79  TEST_PADPAD-1.5MM  [TEST_PAD-1.5MM]  195.97,111.78 0 bottom
P80  TEST_PADPAD-1.5MM  [TEST_PAD-1.5MM]  196,116.75 0 bottom
Q1  BSS138W_SOT323  [MOS_SOT323]  217.45,43.3 270 top
Q2  BSS138W_SOT323  [MOS_SOT323]  217.45,46.7 270 top
Q3  XR65P02D  [PDFN3333]  202.23,88.12 180 top
Q4  BSS138W_SOT323  [MOS_SOT323]  126.05,117.49 270 top
Q5  XR65P02D  [PDFN3333]  201.48,92.86 90 top
Q6  BSS138W_SOT323  [MOS_SOT323]  125.95,120.75 270 top
Q7  BSS138W_SOT323  [MOS_SOT323]  125.95,124.14 270 top
Q8  BSS138W_SOT323  [MOS_SOT323]  179.35,119.66 270 top
Q9  BSS138W_SOT323  [MOS_SOT323]  179.35,123.05 270 top
Q10  AO3401  [PMOS_SOT23]  192.45,22.75 180 top
Q11  AO3401_NC  [PMOS_SOT23]  75.32,56.51 270 top
R1  10K  [R0603]  116.38,93.49 0 top
R2  100K  [R0603]  116.33,99.67 270 top
R3  5.1K  [R0603]  212.53,79.88 270 top
R4  5.1K  [R0603]  212.53,71.29 270 top
R5  10K  [R0603]  192.28,83.55 90 top
R6  0R  [R0603]  195.45,76.44 0 top
R7  0R  [R0603]  195.45,77.84 0 top
R8  0R  [R0603]  184.7,77.54 0 top
R9  10K  [R0603]  187.92,83.6 270 top
R10  0R  [R0603]  184.7,79.01 0 top
R11  22.1K  [R0603]  117.83,99.67 90 top
R12  0R  [R0402]  102.25,94.56 0 top
R13  0R  [R0603]  115.32,84.41 180 top
R14  NC/499K  [R0603]  116.3,90.75 270 top
R15  10K  [R0603]  13.44,19.05 90 top
R16  2K  [R0603-SP]  173.39,2.86 0 top
R17  5.1K  [R0603]  182.1,5.06 0 top
R18  10K  [R0603]  206.28,84.24 180 top
R19  0R  [R0402]  89.84,94.22 180 top
R20  0R  [R0402]  87.72,94.24 0 top
R21  NC/499K  [R0603]  117.74,90.73 90 top
R22  4.7K  [R0603]  128.14,120.75 270 top
R23  0R  [C0402]  105.16,79.75 270 top
R24  0R  [R0603]  120.82,87.08 90 top
R25  0R  [R0603-SP]  93.94,54.18 270 top
R26  4.7K  [R0603]  218.87,65.35 90 top
R27  10K  [R0603]  14.94,19.05 90 top
R28  10K  [R0603]  18.14,19.15 90 top
R29  10K  [R0603]  19.61,19.15 90 top
R30  10K  [R0603]  22.73,19.15 90 top
R31  2K  [R0603-SP]  165.3,8.32 180 top
R32  2K  [R0603-SP]  165.3,6.91 180 top
R33  10K/NC  [R0603]  21.16,19.15 270 top
R35  NC/10M  [R0402]  85.82,91.47 90 top
R36  0R  [R0402]  85.28,87.09 90 top
R37  0R  [R0402]  85.28,82.41 90 top
R38  0R  [R0402]  87.39,74.79 180 top
R39  0R  [R0402]  105.12,83.67 270 top
R40  0R  [R0402]  105.14,81.63 90 top
R41  0R  [R0402]  93.17,94.89 180 top
R42  0R  [R0402]  85.28,79.63 270 top
R43  0R  [R0402]  105.48,92.27 90 top
R44  0R  [R0402]  96.07,95.17 0 top
R45  4.7K  [R0603]  215.34,46.7 270 top
R46  4.7K  [R0603]  219.54,46.7 90 top
R47  5.1K  [R0603]  173.39,4.36 180 top
R48  0R  [R0603]  185.62,127.7 180 top
R49  0R  [R0603]  185.63,126.19 180 top
R50  5.1K  [R0603]  182.1,3.67 0 top
R51  4.7K  [R0603]  219.53,43.3 270 top
R52  4.7K  [R0603]  215.35,43.3 270 top
R53  10K  [R0603]  81.64,39.65 90 top
R54  10K  [R0603]  11.85,19.08 270 top
R55  0R  [R0603]  184.92,83.58 270 top
R56  4.7K  [R0603]  123.85,120.75 270 top
R57  4.7K  [R0603]  123.85,117.49 270 top
R58  4.7K  [R0603]  128.13,117.49 90 top
R59  4.7K  [R0603]  128.13,123.86 90 top
R60  0R  [R0603]  185.6,87.21 180 top
R61  10K  [R0603]  86.26,122.83 180 top
R62  4.7K  [R0603]  123.85,124.14 270 top
R63  100K  [R0402]  121.39,60 90 top
R64  100K  [R0402]  120.46,60 270 top
R65  0R  [R0603]  84.87,42.38 180 top
R66  10K  [R0603]  86.18,128.53 180 top
R67  10K  [R0603]  113.05,110.14 180 top
R68  100K  [R0402]  104.08,58.94 90 top
R69  4.7K  [R0603-SP]  100.44,102.67 0 top
R70  0R  [R0402]  105.55,90.32 270 top
R71  10K  [R0603]  192.55,25.46 180 top
R72  10K  [R0402]  32.12,114.59 180 top
R73  10K  [R0402]  32.12,113.65 180 top
R74  4.7K  [R0603]  54.81,113.37 180 top
R75  4.7K/NC  [R0603]  54.79,114.81 180 top
R76  0R  [R0603]  7.05,94.1 270 top
R77  10K  [R0603]  12.27,94.1 270 top
R78  4.7K  [R0603]  202.04,95.29 0 top
R79  OR  [R0603-SP]  54.79,12.44 0 top
R80  0R  [R0402]  94.68,74.78 0 top
R81  51K  [R0603]  17.53,94.14 90 top
R82  51K  [R0603]  18.93,94.14 90 top
R83  51K  [R0603]  20.35,94.14 90 top
R84  51K  [R0603]  21.78,94.14 90 top
R85  51K  [R0603]  23.2,94.14 90 top
R86  51K  [R0603]  24.63,94.14 90 top
R87  10K  [R0603]  16.12,94.14 90 top
R88  0R  [R0402]  66.84,87.68 180 top
R89  0R  [R0402]  66.84,85.68 180 top
R90  0R  [R0402]  66.84,86.68 180 top
R91  10K  [R0603]  186.38,83.58 90 top
R92  0R  [R0402]  92.62,72.58 90 top
R93  4.7K  [R0603]  181.75,122.94 270 top
R94  4.7K  [R0603]  181.74,119.85 270 top
R95  0R  [R0402]  90.72,72.58 90 top
R96  5.1K  [R0603]  212.27,59.53 270 top
R97  4.7K  [R0603]  174.83,121.44 270 top
R98  4.7K  [R0603]  176.25,121.44 270 top
R99  0R  [R0402]  89.83,72.58 90 top
R100  0R  [R0402]  91.32,75.38 90 top
R101  5.1K  [R0603]  212.56,51.23 270 top
R102  0R  [R0402]  92.22,75.38 90 top
R103  0R  [R0603]  119.21,90.72 90 top
R104  4.02K  [R0402]  89.22,75.42 90 top
R105  0R  [R0402]  83.42,79.16 90 top
R106  10K  [R0603]  185.6,85.78 0 top
R107  0R_NC  [R0402]  82.47,79.16 90 top
R108  100K  [R0402]  105.05,58.94 270 top
R109  0R  [R0402]  98.83,94.58 0 top
R110  0R/NC  [R0402]  106.15,79.74 270 top
R111  0R/NC  [R0402]  57.87,80.18 180 top
R112  0R  [R0603]  63.26,15.4 270 top
R113  0R  [R0603]  192.49,29.75 0 top
R114  0R  [R0603]  192.49,31.15 0 top
R115  0R  [R0603]  192.49,28.35 0 top
R116  10K  [R0603]  145.78,8.15 90 top
R117  100K  [R0603]  196.08,27.31 0 top
R118  0R  [R0603]  153.4,3.47 0 top
R119  0R  [R0603]  153.38,1.98 0 top
R120  5.1K_NC  [R0603]  165.3,5.51 180 top
R121  5.1K_NC  [R0603]  165.3,9.73 180 top
R122  100K  [R0402]  107.1,58.94 90 top
R123  100K  [R0402]  106.13,58.94 270 top
R124  0R  [R0402]  32.12,115.54 180 top
R125  0R  [R0402]  32.12,116.48 180 top
R126  0R/NC  [R0402]  102.33,72.59 270 top
R127  0R  [R0402]  103.27,72.59 270 top
R128  0R/NC  [R0402]  57.87,81.12 180 top
R129  0R  [R0603]  64.72,15.4 270 top
R130  0R/NC  [R0402]  57.87,82.01 180 top
R131  10K  [R0402]  9.65,115.9 0 top
R132  OR  [R0402]  9.65,114.93 180 top
R134  OR  [R0402]  6.46,114.97 270 top
R139  100K  [R0603]  61.67,15.35 90 top
R141  OR  [R0402]  9.65,118.77 0 top
R142  OR  [R0402]  9.65,119.77 0 top
R143  50K  [R0603-SP]  67.69,15.4 270 top
R144  OR  [R0402]  7.36,114.97 90 top
R145  OR  [R0402]  9.65,117.82 0 top
R146  10K  [R0402]  77.93,79.16 90 top
R147  OR  [R0603-SP]  43.19,12.04 0 top
R148  0R  [R0402]  22.24,105.72 180 top
R149  0R  [R0603]  66.23,15.4 270 top
R152  100R  [R0402]  95.86,72.6 270 top
R153  100R  [R0402]  96.71,72.6 270 top
R154  100R  [R0402]  98.64,72.6 270 top
R155  100R  [R0402]  99.53,72.6 270 top
R156  100R  [R0402]  98.07,75.3 270 top
R157  100R  [R0402]  97.17,75.3 270 top
R158  4.02K  [R0402]  100.07,75.3 270 top
R159  0.75R  [R0603-SP]  87.91,59.46 90 top
R160  10K  [R0603]  84.31,60.43 0 top
R161  0R_NC  [R0402]  107.05,72.61 270 top
R162  0R  [R0402]  106.11,72.61 270 top
R163  NC  [R0603-SP]  89.31,59.46 90 top
R164  39k  [R0603]  159.49,1.89 90 top
R165  100K  [R0603]  73.26,43.36 180 top
R166  210K  [R0603]  73.1,50.73 90 top
R167  12K  [R0603]  71.67,50.72 270 top
R168  1.5K  [R0402]  108.19,58.92 270 top
R169  1K  [R0402]  111.21,58.93 270 top
R170  0R  [R0402]  29.13,108.28 0 top
R171  10K  [R0402]  9.65,116.86 0 top
R172  3.9K  [R0603]  85.61,50.09 90 top
R173  51K  [R0603]  89.27,50.09 270 top
R174  3.9K  [R0603]  85.46,45.58 90 top
R175  51K  [R0603]  89.27,45.58 270 top
R177  0R  [R0402]  29.13,109.24 0 top
R178  20K  [R0603]  54.74,6.24 0 top
R179  20K  [R0603]  43.19,6.24 180 top
R180  10K  [R0603]  72.8,56.51 270 top
R181  10K  [R0603]  76.28,120.02 270 top
R182  0R  [R0805]  7.26,122.23 270 top
R184  0R  [R0603]  77.91,56.51 90 top
R185  OR  [R0603-SP]  43.19,3.14 0 top
R186  100k  [R0603]  156.68,1.89 270 top
R187  39k  [R0603]  157.26,14.03 90 top
R188  0R  [R0603]  161.71,14.03 90 top
R189  0R  [R0603]  160.22,14.01 90 top
R190  0R  [R0402]  93.51,72.58 90 top
R200  0R  [R0402]  22.24,104.8 180 top
R210  NC/10K  [R0603]  118.28,84.41 180 top
R216  0R  [R0402]  79.21,90.94 90 top
R217  0R  [R0402]  77.37,90.93 90 top
R332  0R  [R0402]  78.29,90.93 90 top
SW1  switch_6pin  [SWITCH_6PIN_2P]  217.98,92.7 90 top
TP1  TPTP08R  [TP08R]  105.79,117.04 90 top
TP2  TPTP08R  [TP08R]  107.29,117.04 90 top
TP3  TPTP08R  [TP08R]  107.44,115.25 90 top
TP4  TPTP08R  [TP08R]  108.91,115.22 90 top
TP5  TPTP08R  [TP08R]  109.1,116.99 90 top
TP6  TPTP08R  [TP08R]  110.72,116.99 90 top
TP7  TPTP08R  [TP08R]  116.23,59.67 0 top
TP8  TPTP08R  [TP08R]  114.69,59.65 0 top
TP9  TPTP08R  [TP08R]  114.63,57.88 0 top
TP10  TPTP08R  [TP08R]  113.12,57.87 0 top
TP11  TPTP08R  [TP08R]  113.1,60.83 0 top
TP12  TPTP08R  [TP08R]  111.59,60.81 0 top
TP13  TPTP08R  [TP08R]  112.48,117.02 90 top
TP14  TPTP08R  [TP08R]  95.56,121.84 90 top
TP15  TPTP08R  [TP08R]  116.08,117.13 90 top
TP16  TPTP08R  [TP08R]  122.87,120.77 90 top
TP17  TPTP08R  [TP08R]  122.91,122.7 90 top
TP18  TPTP08R  [TP08R]  93.66,126.65 90 top
U1  CH340K  [ESOP-10-EP-150MIL]  190.22,78.62 180 top
U2  TP4059-SOT23-6  [SOT23-6L]  177.76,4.43 90 top
U3  NS4168  [NS4168-ESOP-8]  200.58,28.37 270 top
U4  NS4263B  [SOP16]  46.24,12.34 270 top
U6  MT9201  [COOPER_SOT23-6]  84.31,57.92 90 top
U7  ESP32-P4NRW32  [IC_ESP32-P4NRW32]  94.13,85.27 0 top
U8  UMH3NTN  [SOP65P210X100-6N]  190.14,83.62 90 top
U9  MT3406_C22462728  [SOT95P280X145-5N]  116.44,96.01 0 top
U10  MT3406_C22462728  [SOT95P280X145-5N]  116.3,87.11 0 top
U13  NS4168  [NS4168-ESOP-8]  64.3,9.27 270 top
U14  STC8H1K08-36I  [TSSOP20]  160.26,7.46 270 top
U16  MT3608  [SOT95P280X145-6N]  73.29,46.3 270 top
U176  LMA3526B3811  [MIC-SMD_5P-L3.5-W2.7]  3.02,118.62 270 top
Y2  40MHZ  [X322540MPB4SI]  89.81,97.65 0 top
Y3  24Mhz  [24MHZ_1631-24003-BTKEYA]  113.04,113.04 90 top
Y4  32.768K  [NORDIC_NRF_XTAL_3215_N]  83.25,91.73 270 top

## Tracks (layer width: path | path; a pad name or v marks a point on that pad's centre or on a via)
3V3$
  Top 0.406: C2.2 186.04,76.62 U1.10
+5V_IN  (via drill 0.35)
  Top 0.152: v218.13,31.8
  Top 0.305: R51.1 217.71,44.06 217.39,43.75 217.39,42.05 216.99,41.65 209.39,41.65
  Top 0.406: R46.1 R51.1
  Top 0.61: D2.+ 207.37,89.54 D4.+
  Top 1: 209.39,41.65 209.39,82.82 | J10.3 v218.13,31.8
  Top 1.5: J10.3 210.54,31.8 209.19,33.15 209.19,41.45 | 209.19,41.45 209.39,41.65 | 209.19,41.45 209.19,87.77 208.33,88.64 D2.+
  Bottom 0.152: P42.P$1 219.55,31.8
  Bottom 1: 219.55,31.8 v218.13,31.8
+VBUS1  (via drill 0.3 pad 0.6, 0.35)
  Top 0.102: J1.A9 216.56,78.37 217.12,77.81 217.16,77.81 217.72,77.25 217.72,74.04 217.25,73.57 J1.B9
  Top 0.3: 214.45,78.04 214.42,78.07 213.99,78.5 213.99,78.65 | 214.81,78.37 214.43,78.74 213.91,78.74
  Top 0.305: J1.B4 214.42,78.07 | 214.45,78.04 213.8,78.04 213.52,78.32 | J1.A9 214.81,78.37 213.97,78.37 213.89,78.45 | J1.B4
  Top 0.61: v207.97,84.82 207.42,85.36 D11.+
  Top 1: 213.91,78.46 213.89,78.45 | 213.99,78.65 213.91,78.74
  Top 1.5: D10.+ 210.23,94.72 212.78,92.18 v212.78,86.07 v213.3,85.55 213.91,84.94 213.91,78.74
  Bottom 0.61: v212.78,86.07 212.78,85.53 212.07,84.82 v207.97,84.82
  Bottom 0.813: P1.P$1 214.49,86.09 214.48,86.07 214.39,85.99 212.87,85.99 v212.78,86.07
  Bottom 1: 214.48,86.07 213.83,86.07 v213.3,85.55
  pour Top (no thermals): 216.37,78.51 216.93,78.51 218.02,77.42 218.02,74.26 216.91,73.14 216.37,73.14 216.37,73.53 217.41,74.43 217.41,77.17 216.37,78.2
+VBUS2  (via drill 0.35)
  Top 0.102: J16.A4 216.81,52.37 217.77,53.33 217.77,56.32 216.63,57.47 J16.A9
  Top 0.3: J16.B4 214.98,57.17 | 214.98,57.17 214.55,57.17 | 214.55,57.17 213.68,57.17 213.38,57.47 214.25,57.47 | J16.A9 214.25,57.47 | 214.25,57.47 213.89,57.83 | 214.25,57.47 214.55,57.17 | 214.98,57.17 214.98,57.27 213.89,58.36
  Top 0.305: J16.B4 215.67,57.27
  Top 0.61: D007.+ 206.38,90.73 206.38,87.87 207.16,87.09 D008.+
  Top 1: 210.89,81.75 210.9,81.75 | 213.79,61.75 213.89,61.75
  Top 1.5: 213.89,61.75 213.89,58.36 213.89,57.83 | D007.+ 209.83,92.67 210.9,91.61 v210.9,82.66 210.9,81.75 | 210.89,81.75 210.89,64.65 213.79,61.75
  Bottom 1: P29.P$1 210.58,83.05 v210.88,83.36 210.9,83.34 v210.9,82.66
  pour Top (no thermals): 216.43,57.55 216.99,57.55 218.08,56.46 218.08,53.31 216.96,52.19 216.43,52.19 216.43,52.58 217.46,53.47 217.46,56.21 216.43,57.25
ADC_AVDD_3V3
  Top 0.203: IC5.22 24.92,115.43 24.69,115.2 | IC5.23 24.96,115.03 24.79,115.2
  Top 0.508: FB5.2 23.24,113.8 C133.2 C132.1 24.32,114.73 24.79,115.2 24.69,115.2
ADC_DVDD_3V3  (via drill 0.3 pad 0.6)
  Top 0.12: 31.06,117.43 31.02,117.47
  Top 0.25: IC5.7 30.33,117.03 30.49,116.87 | IC5.6 29.69,116.65 30.16,116.65 30.38,116.87
  Top 0.254: C130.1 32.02,117.66 32.02,117.61 32.23,117.4 32.97,117.4 32.98,117.4 33.79,117.4 34.36,116.83 34.36,114.29 v34.15,114.08 | R73.1 32.56,113.64 v32.56,112.74
  Top 0.406: FB4.2 C131.2 31.71,117.99 C130.1 31.6,117.98 31.06,117.43 30.49,116.87 30.38,116.87
  Bottom 0.254: v34.15,114.08 34.11,114.03 34.11,113.18 33.67,112.74
  Bottom 0.305: 33.67,112.74 v32.56,112.74
ADC_VBAT
  Top 0.2: U14.13 158.04,2.67 158.02,2.65 R186.1 C158.2 R164.2
AGND  (via drill 0.3 pad 0.6)
  Top 0.508: J4.P$4 v34.08,8.86 v34.09,8.85
  other vias: 37.69,8.85 48.82,3.29 47.84,4.44 56.97,3.46 53.04,10.94 44.94,10.94 45.29,13.98 45.34,15.84 56.74,12.44 63.14,9.94 64.24,9.94 65.44,9.94 63.14,9.04 64.34,9.04 65.44,9.04 58.54,13.14 64.94,5.14 63.34,5.14 64.14,5.14 69.06,15.61 60.88,15.43 53.34,17.34 51.84,17.34 50.54,17.44 45.4,16.88 45.38,14.89 44.94,4.24 47.74,11.14 68.34,11.04 68.44,7.84 58.54,9.54 59.34,7.04 68.54,3.54 47.3,16.88 47.1,13.68
  pour Bottom: 45.23,18.14 67.93,18.14 69.73,16.34 69.73,2.56 68.27,1.1 32.95,1.1 31.49,2.56 31.49,10.94 33.78,13.23 43.04,13.23 43.6,13.79 43.6,16.5
  pour Top (no thermals): 45.21,18.16 67.9,18.16 69.71,16.35 69.71,2.57 68.25,1.11 32.93,1.11 31.47,2.57 31.47,10.95 33.75,13.24 43.01,13.24 43.57,13.8 43.57,16.52
AGND1  (via drill 0.3 pad 0.6, 0.35 pad 0.6)
  Top 0.102: U176.5_1 2.98,118.82 | v2.29,120.09 2.29,119.69 2.47,119.51 2.47,119.44
  Top 0.12: R145.2 10.87,117.82 v10.89,117.8 | 24.21,115.83 v24.09,115.7 | 2.88,118.52 2.88,118.38 | IC6.10 28.37,105.83 28.29,105.91
  Top 0.2: IC5.21 24.21,115.83 | 28.29,105.91 27.13,105.91 v27.09,105.95
  other vias: 2.28,117.24 5.79,121.25 6.89,120.15 7.69,120.15 8.59,121.15 10.89,116.75 21.39,113.95 21.39,114.85 21.39,117.35 21.39,118.35 21.79,110.15 23.19,108.35 21.89,106.75 21.89,103.85 23.29,101.95 23.39,103.75 23.39,102.85 26.49,101.75 34.49,103.95 33.59,101.95 34.49,105.55 24.09,110.15 25.19,110.15 26.39,110.15 27.49,110.15 28.79,110.15 15.79,115.25 15.79,117.05 6.89,118.15 17.94,118.59 3.8,113.84 21.59,112.15
  pour Top (no thermals): 10.19,121.85 1.99,121.85 1.29,121.15 1.29,115.65 4.49,112.45 20.49,112.45 21.39,111.55 21.39,103.15 23.49,101.05 33.89,101.05 34.89,102.05 34.89,105.95 34.79,106.05 32.19,106.05 31.89,105.75 31.89,103.95 30.99,103.05 27.59,103.05 27.49,103.15 27.49,109.35 27.99,109.85 29.29,109.85 29.69,110.25 29.69,111.35 29.59,111.45 24.39,111.45 24.39,118.75 23.89,119.25 12.79,119.25
  pour Bottom (no thermals): 10.19,121.85 1.99,121.85 1.29,121.15 1.29,115.65 4.49,112.45 20.49,112.45 21.39,111.55 21.39,103.15 23.49,101.05 33.89,101.05 34.89,102.05 34.89,105.95 34.79,106.05 32.19,106.05 31.89,105.75 31.89,103.92 31.02,103.05 27.59,103.05 27.49,103.15 27.49,109.45 27.89,109.85 29.29,109.85 29.69,110.25 29.69,111.35 29.59,111.45 24.39,111.45 24.39,118.75 23.89,119.25 12.79,119.25
AGND3  (via drill 0.35 pad 0.6)
  Top 0.102: FB20.2 204.92,24.27 v204.89,24.3
  other vias: 204.95,22.01 204.17,22.01 204.14,24.28 199.81,28.77 201.34,28.77 199.86,27.85 201.34,27.88 201.38,24.11 200.15,24.11 192.83,18.89 196.72,18.89 200.82,19.5 203.87,16.43 205.57,12.91 205.68,9.55 205.68,5.95 207.58,5.87 207.56,9.55 207.56,12.91 207.25,16.79 204.2,20.06 204.35,30.48 201.7,32.69 195.1,32.63 189.41,28.23 190.01,26.17 190.07,31.01 189.46,24.42 194.01,27.04 197.36,30.48 197.92,24.25 190.13,21.48
  pour Bottom (no thermals): 191.2,33.22 203.27,33.22 205.62,30.87 205.62,20.23 210.79,15.06 210.79,5.86 209.92,5 203.91,5 202.49,6.42 202.49,16.62 200.64,18.47 189.47,18.47 188.74,19.19 188.74,30.76
  pour Top (no thermals): 191.23,33.25 203.3,33.25 205.65,30.9 205.65,20.25 210.81,15.08 210.81,5.89 209.95,5.03 203.94,5.03 202.52,6.45 202.52,16.65 200.67,18.49 189.5,18.49 188.77,19.22 188.77,30.79
AUDIO_CTRL  (via drill 0.35, 0.35 pad 0.6)
  Top 0.2: R117.2 196.02,26.49 194.86,26.49 194.29,25.92 194.29,22.65 193.38,21.73 Q10.3 191.48,21.73 190.19,20.45 v190.19,19.25 | R139.2 61.74,16.11 v62.44,15.41 | v92.4,19.9 92.74,19.9 93.07,19.57 150.82,19.57 151.6,20.35 153.36,20.35 v153.99,19.72
  Bottom 0.2: v92.4,19.9 92.23,19.9 91.6,19.27 76.98,19.27 74,16.29 63.32,16.29 v62.44,15.41 | v153.99,19.72 158.51,24.25 181.37,24.25 186.36,19.25 v190.19,19.25
AUDIO_OUT_3V3  (via drill 0.3 pad 0.6)
  Top 0.61: FB15.2 53.41,14.67 C148.2 53.37,14.67 C134.2 C154.1 49.84,14.02 49.84,9.04 v50.04,8.84 50.35,8.53 U4.13 | U4.4 46.25,8.54 v47.64,8.54
  Bottom 0.61: v47.64,8.54 49.74,8.54 v50.04,8.84
AUDIO_OUT_SD  (via drill 0.3, 0.3 pad 0.6)
  Top 0.12: U7.60 100.29,83.34 100.8,82.83 100.8,79.17 105.1,74.87 112.58,74.87 v116.05,71.39 v116.06,71.39 | v190.29,27.35 190.34,27.39 192.75,27.39 193.49,26.65 193.49,25.64 R71.1 193.34,25.43 Q10.1 | R147.1 42.43,12.13 43.02,12.73 44.92,12.73 46.25,14.06 46.25,18.6 v47.08,19.43 | v116.34,67.45 117.15,67.45 124.67,59.93 124.67,40.83 v122.18,38.34 | v122.19,25.05 122.13,25.11 76.7,25.11 v76.6,25.01 | v122.19,25.05 | v122.19,25.05 152.59,25.05 v152.99,25.45
  Bottom 0.12: v116.34,67.45 116.06,67.73 v116.06,71.39 | v122.18,38.34 122.18,25.07 v122.19,25.05 | v47.08,19.43 47.22,19.56 71.15,19.56 v76.6,25.01 | v190.29,27.35 189.68,26.74 154.28,26.74 v152.99,25.45
AUDIO_VDD1
  Top 0.508: FB17.1 C104.1 60.17,14.54 C102.1 C103.1 61.74,9.04 61.74,8.34 62.34,7.74 62.84,7.74 63.67,6.92 U13.6
AUDIO_VDD2
  Top 0.508: FB18.1 C22.1 C23.1 C24.1 196.87,25.92 197.79,26.85 199.49,26.85 199.95,26.39 U3.6
AUDIO_VDD_3V3  (via drill 0.3 pad 0.6)
  Top 0.508: FB6.1 5.39,113.82 5.91,113.3 18.39,113.3 v18.69,113 | v20.99,113.1 21.17,112.92 FB5.1 22.35,110.64 23.99,109 25.72,109 27.35,107.37 29.79,107.37 33.05,110.63 v33.05,110.9
  Top 0.61: IC7.5 71.7,119.27 C152.2 C153.2 FB16.2 40.62,119.27 v39.89,120 | FB4.1 32.64,119.89 32.86,119.89 33.67,119.07 v33.85,119.07 35.29,117.64 35.29,110.04 v34.72,109.47 33.57,108.32 FB14.1
  Bottom 0.508: v18.69,113 20.89,113 v20.99,113.1 | v34.72,109.47 34.48,109.47 v33.05,110.9
  Bottom 0.61: v39.89,120 34.79,120 v33.85,119.07
AVDD_2V8  (via drill 0.3 pad 0.6, 0.35)
  Top 0.12: TP18.TP 94.52,126.65 v94.54,126.63
  Top 0.3: FPC3.2 116.66,120.26 116.94,120.54 117.16,120.32 FPC3.1
  Top 0.61: IC3.5 90.67,126.87 C82.2 C83.2 92.37,126.69 94.48,126.69 | v94.54,126.63 94.48,126.69 | v95.14,126.63 95.08,126.69 94.48,126.69 | v116,123.76 v116.76,123.76 116.94,123.58 116.94,120.54
  Bottom 0.61: v94.54,126.63 95.44,126.63 97.37,124.69 97.37,124.68 98.27,123.78 116.74,123.78 v116.76,123.76
C6_BOOT  (via drill 0.35 pad 0.6)
  Top 0.12: IC1.23 15.17,107.82 v14.75,108.24
  Bottom 0.12: v14.75,108.24 14.69,108.3 P36.P$1
C6_EN  (via drill 0.3, 0.3 pad 0.6)
  Top 0.12: U7.63 100.08,84.39 100.29,84.61 100.82,84.61 101.34,84.09 101.34,79.26 105.15,75.45 113.52,75.45 127.58,61.39 v127.58,40.55 | v27.46,96.98 27.46,82.83 32.17,78.12 55.32,78.12 56.73,76.71 56.73,44.25 67.14,33.84 121,33.84 126.22,39.06 v126.28,39.06 | v15.39,96.2 15.14,96.2 C15.1 R77.1 12.27,96.62 12.49,96.85 IC1.8
  Bottom 0.12: v27.46,96.98 27.24,97.2 25.39,97.2 24.79,97.8 16.99,97.8 15.86,96.68 v15.39,96.2 | v127.58,40.55 127.58,40.35 126.29,39.06 v126.28,39.06
  Bottom 0.152: P37.P$1 16.28,97.1 15.86,96.68
C6_IO8
  Top 0.12: IC1.22 16.07,107.02 16.66,106.43 16.66,96.25 16.12,95.71 R87.2
C6_RXD0  (via drill 0.3 pad 0.6)
  Top 0.12: IC1.30 10.89,110.41 v11.29,110.8
  Bottom 0.12: v11.29,110.8 12.25,109.84 P21.P$1
C6_TXD0  (via drill 0.3 pad 0.6)
  Top 0.12: IC1.31 v10.09,110.8
  Bottom 0.12: v10.09,110.8 10.09,110.08 P25.P$1
C6_VDD_3V3  (via drill 0.35)
  Top 0.12: C14.2 9.97,95.7 v10.13,95.86
  Top 0.508: IC1.3 8.49,94.91 C11.1 | C14.2 11.49,93.34 R77.2 13.51,92.1 14.84,92.1 R87.1 R81.1 R82.1 R83.1 R84.1 R85.1 R86.1
  Top 0.61: R76.1 C11.1 C14.2
  Bottom 0.12: v10.13,95.86 10.13,97 P44.P$1
CODEC_3V3  (via drill 0.3 pad 0.6)
  Top 0.2: IC6.4 31.57,104.53 v31.57,104.5 31.21,104.13 IC6.3 | FB13.2 24.3,107.82 24.69,108.21 25.68,108.21 27.01,106.88 30.31,106.88 v30.53,107.1
  Top 0.406: FB14.2 C145.1 32.68,104.73 C146.2 32.48,104.5 v31.57,104.5 | v31.57,104.5
  Bottom 0.2: v31.57,104.5 31.54,104.5 31.54,106.05 30.53,107.07 v30.53,107.1
CSI_CLK_N  (via drill 0.2, 0.2 pad 0.4)
  Top 0.12: R156.2 98.07,74.73 97.72,74.37 97.72,70.19 97.9,70 98.1,70 v98.25,70.15 | v72.22,88.33 72.06,88.49 72.06,101.88 80.33,110.14 87.47,110.14 102.45,125.13 107.33,125.13 108.26,124.2 108.26,119.48 FPC3.19 108.26,119.28 108.26,117.69 108.06,117.48 108.06,115.84 107.47,115.25 TP3.TP 107.43,115.26
  Bottom 0.12: v72.22,88.33 72.06,88.16 72.06,72.76 74.32,70.5 94.61,70.5 94.76,70.65 96.99,70.65 97.66,69.98 98.08,69.98 v98.25,70.15
CSI_CLK_P  (via drill 0.2, 0.2 pad 0.4)
  Top 0.12: v98.29,69.57 98.14,69.72 97.84,69.72 97.39,70.17 97.39,74.64 R157.2 | v71.65,88.34 71.8,88.5 71.8,101.93 80.25,110.38 87.39,110.38 102.36,125.35 107.45,125.35 108.57,124.23 108.57,119.47 FPC3.18 108.57,119.29 108.57,117.69 108.28,117.39 108.28,115.86 TP4.TP
  Bottom 0.12: v71.65,88.34 71.8,88.19 71.8,72.7 74.23,70.28 94.7,70.28 94.84,70.42 96.9,70.42 97.58,69.74 98.12,69.74 v98.29,69.57
CSI_D0_N  (via drill 0.2, 0.2 pad 0.4)
  Top 0.12: R152.2 96.26,71.76 96.26,70.32 95.9,69.95 95.23,69.95 v95.19,69.98 | v70.68,88.35 70.54,88.49 70.54,101.49 79.79,110.74 86.88,110.74 102.07,125.93 108.89,125.93 109.76,125.06 109.76,119.48 FPC3.16 109.74,119.3 109.74,117.62 TP5.TP
  Bottom 0.12: v95.19,69.98 95.04,69.83 74,69.83 70.5,73.33 70.5,88.17 v70.68,88.35
CSI_D0_P  (via drill 0.2, 0.2 pad 0.4)
  Top 0.12: R153.2 96.71,71.96 96.51,71.76 96.51,70.18 96,69.66 95.47,69.66 95.23,69.42 v95.2,69.42 | v70.11,88.35 70.28,88.52 70.28,101.61 79.65,110.97 86.73,110.97 101.94,126.18 108.99,126.18 110.06,125.11 110.06,119.48 FPC3.15 110.1,119.32 110.1,117.61 TP6.TP
  Bottom 0.12: v70.11,88.35 70.27,88.2 70.27,73.24 73.93,69.58 95.04,69.58 v95.2,69.42
CSI_D1_N  (via drill 0.2, 0.2 pad 0.4)
  Top 0.12: R154.2 98.97,71.83 98.97,71.48 98.75,71.26 98.53,71.26 v98.44,71.34 | v73.67,88.33 73.47,88.54 73.47,102.11 80.79,109.43 88.12,109.43 103.19,124.51 106.02,124.51 106.76,123.77 106.76,119.48 FPC3.22 106.72,119.32 106.72,118.39 106.47,118.14 106.47,117.41 106.11,117.04 TP1.TP
  Bottom 0.12: v73.67,88.33 73.47,88.13 73.47,72.41 74.67,71.21 98.31,71.21 v98.44,71.34
CSI_D1_P  (via drill 0.2, 0.2 pad 0.4)
  Top 0.12: R155.2 99.24,71.87 99.24,71.39 98.79,70.94 98.6,70.94 v98.44,70.77 | v73.04,88.35 73.22,88.52 73.22,102.19 80.71,109.68 88.03,109.68 103.1,124.76 106.16,124.76 107.06,123.86 107.06,119.48 FPC3.21 107.08,119.3 107.08,118.37 106.73,118.01 106.73,117.37 107.06,117.04 | 107.31,117.06 TP2.TP 107.06,117.04 | 107.06,117.04 107.16,116.94
  Bottom 0.12: v73.04,88.35 73.23,88.16 73.23,72.26 74.55,70.94 98.27,70.94 v98.44,70.77
CSI_RESET
  Top 0.12: R57.2 123.86,116.74 123.98,116.86 Q4.2 | TP15.TP 115.91,117.13 115.48,117.56 114.49,117.56 113.8,118.25 113.8,119.24 FPC3.8
  Top 0.2: FPC3.8 113.66,120.41 113.66,123.74 114.93,125.01 121.03,125.01 121.56,124.48 121.56,118.95 123.77,116.74 123.86,116.74
CSI_SCL  (via drill 0.35)
  Top 0.12: R62.2 123.91,123.43 123.98,123.5 Q7.2 | TP17.TP 122.91,123.53 v122.94,123.56
  Top 0.2: FPC3.4 115.66,120.63 114.62,121.67 114.62,123.42 115.61,124.41 120.1,124.41 120.82,123.69 v120.82,123.67 | v122.94,123.56 123.77,123.56 123.91,123.43
  Bottom 0.2: v120.82,123.67 122.82,123.67 v122.94,123.56
CSI_SDA  (via drill 0.35)
  Top 0.12: Q6.2 124.94,119.99 123.96,119.99 R56.2 | TP16.TP 123.05,120.77 123.84,119.99